# Altium schematic sheet SMARC Pinout-1.SchDoc
size A4; SheetNumber: 5; SheetTotal: 10
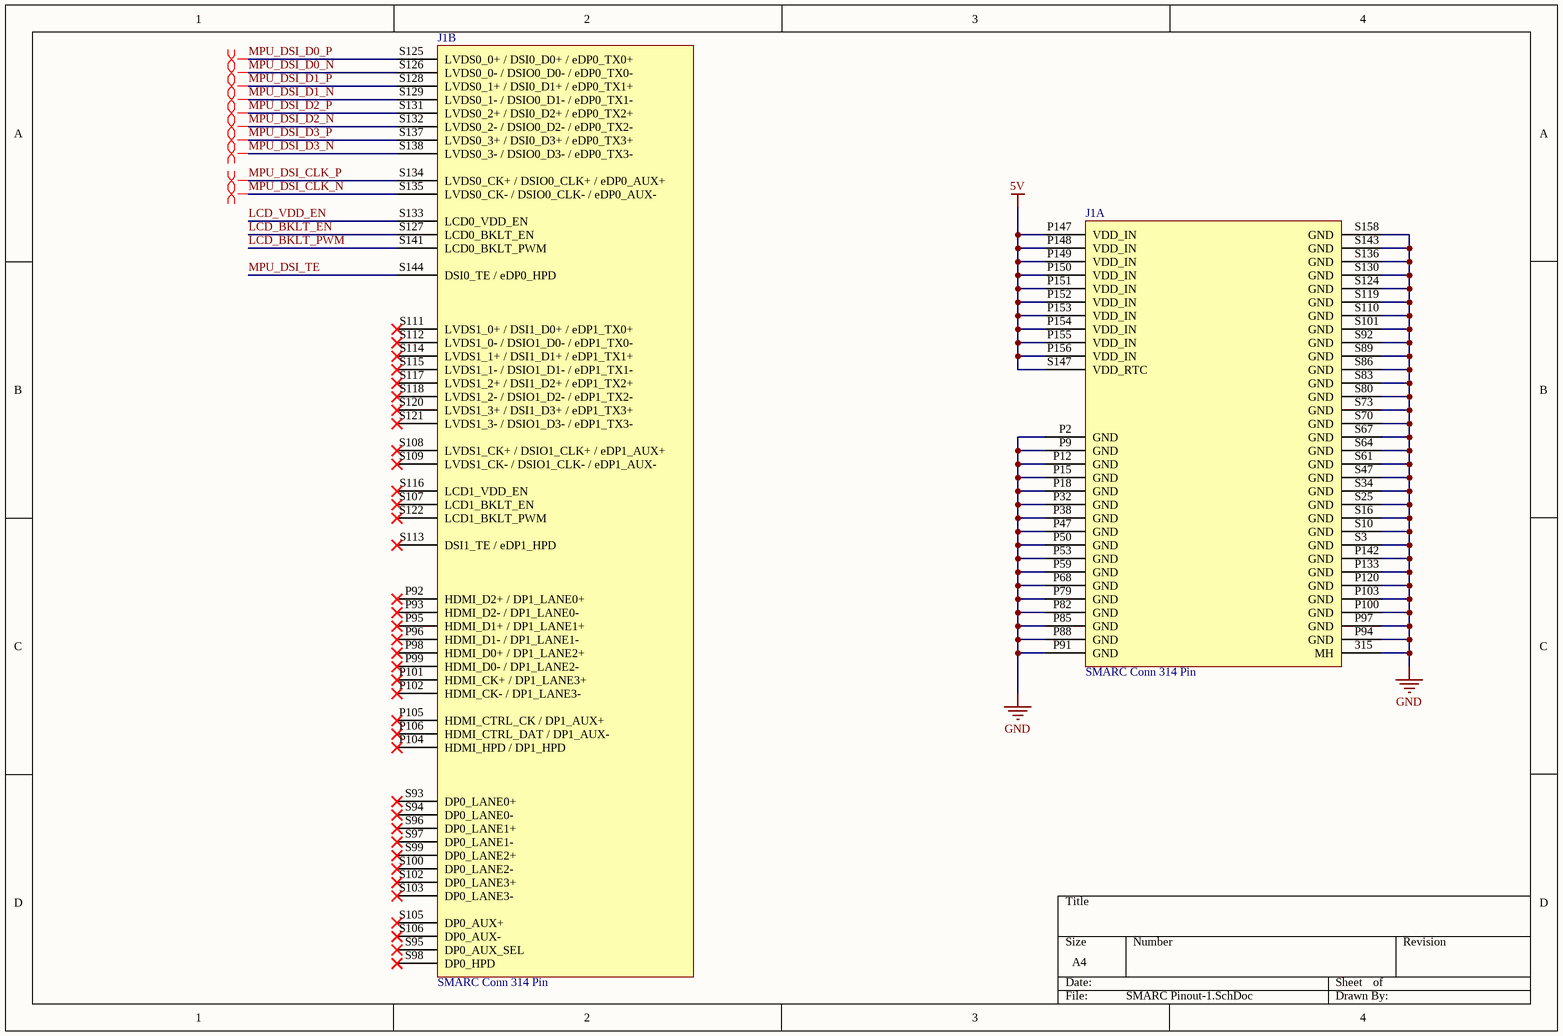
[diagram p0: SMARC Pinout-1.SchDoc]

## Parts
J1  SMARC Conn 314 Pin  [SMARC Conn 314 Pin]  (parts A,B of 6)

## Nets
5V: J1.P147(VDD_IN) J1.P148(VDD_IN) J1.P149(VDD_IN) J1.P150(VDD_IN) J1.P151(VDD_IN) J1.P152(VDD_IN) J1.P153(VDD_IN) J1.P154(VDD_IN) J1.P155(VDD_IN) J1.P156(VDD_IN) J1.S147(VDD_RTC)
GND: J1.315(MH) J1.P2(GND) J1.P9(GND) J1.P12(GND) J1.P15(GND) J1.P18(GND) J1.P32(GND) J1.P38(GND) J1.P47(GND) J1.P50(GND) J1.P53(GND) J1.P59(GND) J1.P68(GND) J1.P79(GND) J1.P82(GND) J1.P85(GND) J1.P88(GND) J1.P91(GND) J1.P94(GND) J1.P97(GND) J1.P100(GND) J1.P103(GND) J1.P120(GND) J1.P133(GND) J1.P142(GND) J1.S3(GND) J1.S10(GND) J1.S16(GND) J1.S25(GND) J1.S34(GND) J1.S47(GND) J1.S61(GND) J1.S64(GND) J1.S67(GND) J1.S70(GND) J1.S73(GND) J1.S80(GND) J1.S83(GND) J1.S86(GND) J1.S89(GND) J1.S92(GND) J1.S101(GND) J1.S110(GND) J1.S119(GND) J1.S124(GND) J1.S130(GND) J1.S136(GND) J1.S143(GND) J1.S158(GND)
LCD_BKLT_EN: J1.S127(LCD0_BKLT_EN)
LCD_BKLT_PWM: J1.S141(LCD0_BKLT_PWM)
LCD_VDD_EN: J1.S133(LCD0_VDD_EN)
MPU_DSI_CLK_N: J1.S135(LVDS0_CK-_/_DSIO0_CLK-_/_eDP0_AUX-)
MPU_DSI_CLK_P: J1.S134(LVDS0_CK+_/_DSIO0_CLK+_/_eDP0_AUX+)
MPU_DSI_D0_N: J1.S126(LVDS0_0-_/_DSIO0_D0-_/_eDP0_TX0-)
MPU_DSI_D0_P: J1.S125(LVDS0_0+_/_DSI0_D0+_/_eDP0_TX0+)
MPU_DSI_D1_N: J1.S129(LVDS0_1-_/_DSIO0_D1-_/_eDP0_TX1-)
MPU_DSI_D1_P: J1.S128(LVDS0_1+_/_DSI0_D1+_/_eDP0_TX1+)
MPU_DSI_D2_N: J1.S132(LVDS0_2-_/_DSIO0_D2-_/_eDP0_TX2-)
MPU_DSI_D2_P: J1.S131(LVDS0_2+_/_DSI0_D2+_/_eDP0_TX2+)
MPU_DSI_D3_N: J1.S138(LVDS0_3-_/_DSIO0_D3-_/_eDP0_TX3-)
MPU_DSI_D3_P: J1.S137(LVDS0_3+_/_DSI0_D3+_/_eDP0_TX3+)
MPU_DSI_TE: J1.S144(DSI0_TE_/_eDP0_HPD)

Not connected (* = marked no-connect by the designer): J1 P92(HDMI_D2+_/_DP1_LANE0+)* P93(HDMI_D2-_/_DP1_LANE0-)* P95(HDMI_D1+_/_DP1_LANE1+)* P96(HDMI_D1-_/_DP1_LANE1-)* P98(HDMI_D0+_/_DP1_LANE2+)* P99(HDMI_D0-_/_DP1_LANE2-)* P101(HDMI_CK+_/_DP1_LANE3+)* P102(HDMI_CK-_/_DP1_LANE3-)* P104(HDMI_HPD_/_DP1_HPD)* P105(HDMI_CTRL_CK_/_DP1_AUX+)* P106(HDMI_CTRL_DAT_/_DP1_AUX-)* S93(DP0_LANE0+)* S94(DP0_LANE0-)* S95(DP0_AUX_SEL)* S96(DP0_LANE1+)* S97(DP0_LANE1-)* S98(DP0_HPD)* S99(DP0_LANE2+)* S100(DP0_LANE2-)* S102(DP0_LANE3+)* S103(DP0_LANE3-)* S105(DP0_AUX+)* S106(DP0_AUX-)* S107(LCD1_BKLT_EN)* S108(LVDS1_CK+_/_DSIO1_CLK+_/_eDP1_AUX+)* S109(LVDS1_CK-_/_DSIO1_CLK-_/_eDP1_AUX-)* S111(LVDS1_0+_/_DSI1_D0+_/_eDP1_TX0+)* S112(LVDS1_0-_/_DSIO1_D0-_/_eDP1_TX0-)* S113(DSI1_TE_/_eDP1_HPD)* S114(LVDS1_1+_/_DSI1_D1+_/_eDP1_TX1+)* S115(LVDS1_1-_/_DSIO1_D1-_/_eDP1_TX1-)* S116(LCD1_VDD_EN)* S117(LVDS1_2+_/_DSI1_D2+_/_eDP1_TX2+)* S118(LVDS1_2-_/_DSIO1_D2-_/_eDP1_TX2-)* S120(LVDS1_3+_/_DSI1_D3+_/_eDP1_TX3+)* S121(LVDS1_3-_/_DSIO1_D3-_/_eDP1_TX3-)* S122(LCD1_BKLT_PWM)*

## Layout directives
differential pair: MPU_DSI_CLK_N, MPU_DSI_CLK_P, MPU_DSI_D0_N, MPU_DSI_D0_P, MPU_DSI_D1_N, MPU_DSI_D1_P, MPU_DSI_D2_N, MPU_DSI_D2_P, MPU_DSI_D3_N, MPU_DSI_D3_P